# EAGLE design ArduinoProMini.NRF24.DHT.v1.01 (EAGLE 8.1.0)
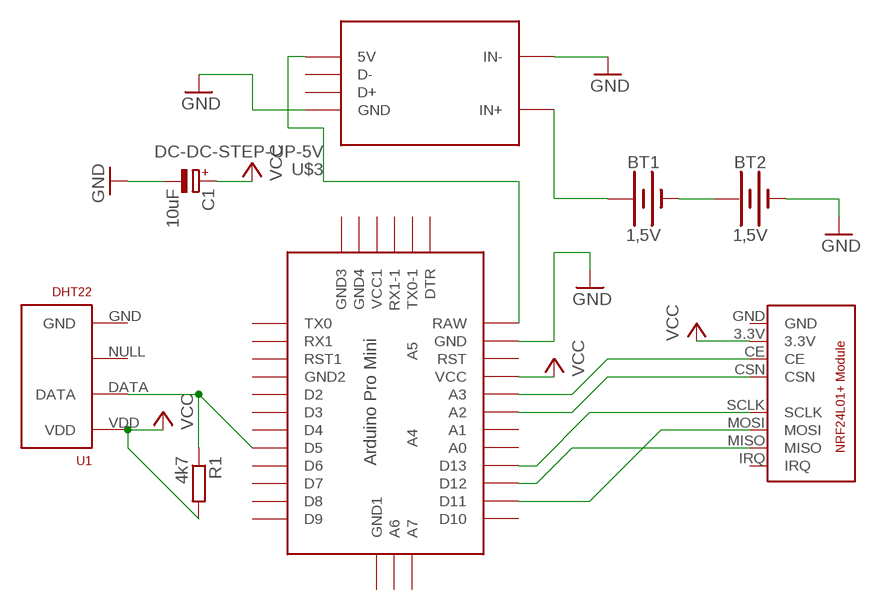
[diagram p0: schematic, sheet 1]

## Parts
BT1  1,5V  BATTERY-AA  [BATTERY-AA]
BT2  1,5V  BATTERY-AA  [BATTERY-AA]
C1  10uF  CPOL-EUE2-5  [E2-5]
R1  4k7  R-EU_0204/7  [0204/7]
U1  DHT22  RHT03_DHT-22_AM2302RA  [RHT03_DHT-22/RA]
U$1  ABK-PRO-MINI  [ABK-PRO-MINI]
U$2  NRF24L01+MODULE  [NRF24L01+MODULE]
U$3  DC-DC-STEP-UP-5V  [DC-DC-STEP-UP-5V]

## Nets
GND: BT2.GND@1(-) C1.- U$1.GND U$3.GND U$3.IN-
N$1: BT1.GND@1(-) BT2.PWR@1(+)
N$2: BT1.PWR@1(+) U$3.IN+
N$3: U$1.A3 U$2.CE
N$4: U$1.A2 U$2.CSN
N$5: U$1.D13 U$2.SCLK
N$6: U$1.D12 U$2.MISO
N$7: U$1.D11 U$2.MOSI
N$8: R1.1 U1.DATA U$1.D5
N$9: U$1.RAW U$3.5V
VCC: C1.+ R1.2 U1.VDD U$1.VCC U$2.3.3V
Unconnected: U1.NULL U$1.A0 U$1.A1 U$1.A4 U$1.A5 U$1.A6 U$1.A7 U$1.D2 U$1.D3 U$1.D4 U$1.D6 U$1.D7 U$1.D8 U$1.D9 U$1.D10 U$1.DTR U$1.GND1(GND2) U$1.GND2(GND3) U$1.GND3(GND4) U$1.GND4(GND1) U$1.RST U$1.RST1 U$1.RX1 U$1.RX1-1 U$1.TX0 U$1.TX0-1 U$1.VCC1 U$2.IRQ U$3.D+ U$3.D-

## Power pins joined to a net without a drawn wire
GND: U1.GND U$2.GND

## Library data of the parts
BT1 BT2 = SparkFun-Batteries:BATTERY: Battery - Single Cell A variety of battery chemistries, sizes, and footprints. Device List: 20MM_PTH - Coin Cell Battery Holder - 20mm (PTH) <https://www.sparkfun.com/products/783> 12MM_SMD - Coin Cell Battery Holder - 12mm (SMD) <https://www.sparkfun.com/products/10592> 12MM_PTH - Coin Cell Battery Holder - 12mm (PTH) <https://www.sparkfun.com/products/7948> 20MM_SMD - 20mm Coin Cell Battery Holder (SMD) (2 legs) Used on the Big Time Watch Kit <https://www.sparkfun.com/products/11734> 20MM_SMD_4LEGS - Coin Cell Battery Holder - 20mm (SMD) <https://www.sparkfun.com/products/11892> 20MM_SMD_4LEGS_OVERPASTE - Coin Cell Battery Holder - 20mm (SMD) <https://www.sparkfun.com/products/11892> (Over-paste on the legs) 24.5MM_PTH - Coin Cell Battery Holder - 24.5mm (PTH) <https://www.sparkfun.com/products/8863> 9V - 9V Battery Holder - PC Mount Used on the SparkFun SparkPunk Sound Kit <https://www.sparkfun.com/products/11177> and SparkFun SparkPunk Sequencer Kit <https://www.sparkfun.com/products/12707> 18650 - Battery Holder - 18650 (PTH) <https://www.sparkfun.com/products/13113> AA - Battery Holder - 1xAA (PTH) <https://www.sparkfun.com/products/7949> AAA - Battery Holder - 1xAAA (PTH) <https://www.sparkfun.com/products/12718> AA_KIT - Battery Holder - 1xAA (PTH) <https://www.sparkfun.com/products/7949> Special kit package - pads only have exposed copper on one side of the board. AAA_KIT - Battery Holder - 1xAAA (PTH) <https://www.sparkfun.com/products/12718> Special kit package - pads only have exposed copper on one side of the board.; PROD_ID: BATT-08316; SF_SKU: PRT-07949
C1 = rcl:CPOL-EU: POLARIZED CAPACITOR, European symbol
R1 = resistor:R-EU_: RESISTOR, European symbol
U1 = RHT03_DHT-22_AM2302:RHT03_DHT-22_AM2302: RHT03 / DHT-22 / AM2302 Packages and symbol for the RHT03 / DHT-22 relative humidity and temperature sensor. Note: The AM2302 is a wired version of the DHT-22 which typically requires less clearance and is thus provided as a separate package.; PROD_ID: SEN-10167
U$1 = Arduino-clone:ABK-PRO-MINI: ABK Pro-Mini Arduino Clone
U$2 = NRF24L01+ Module:NRF24L01+MODULE
U$3 = diy-modules:DC-DC-STEP-UP-5V: DC/DC Step-Up Converter

## Board
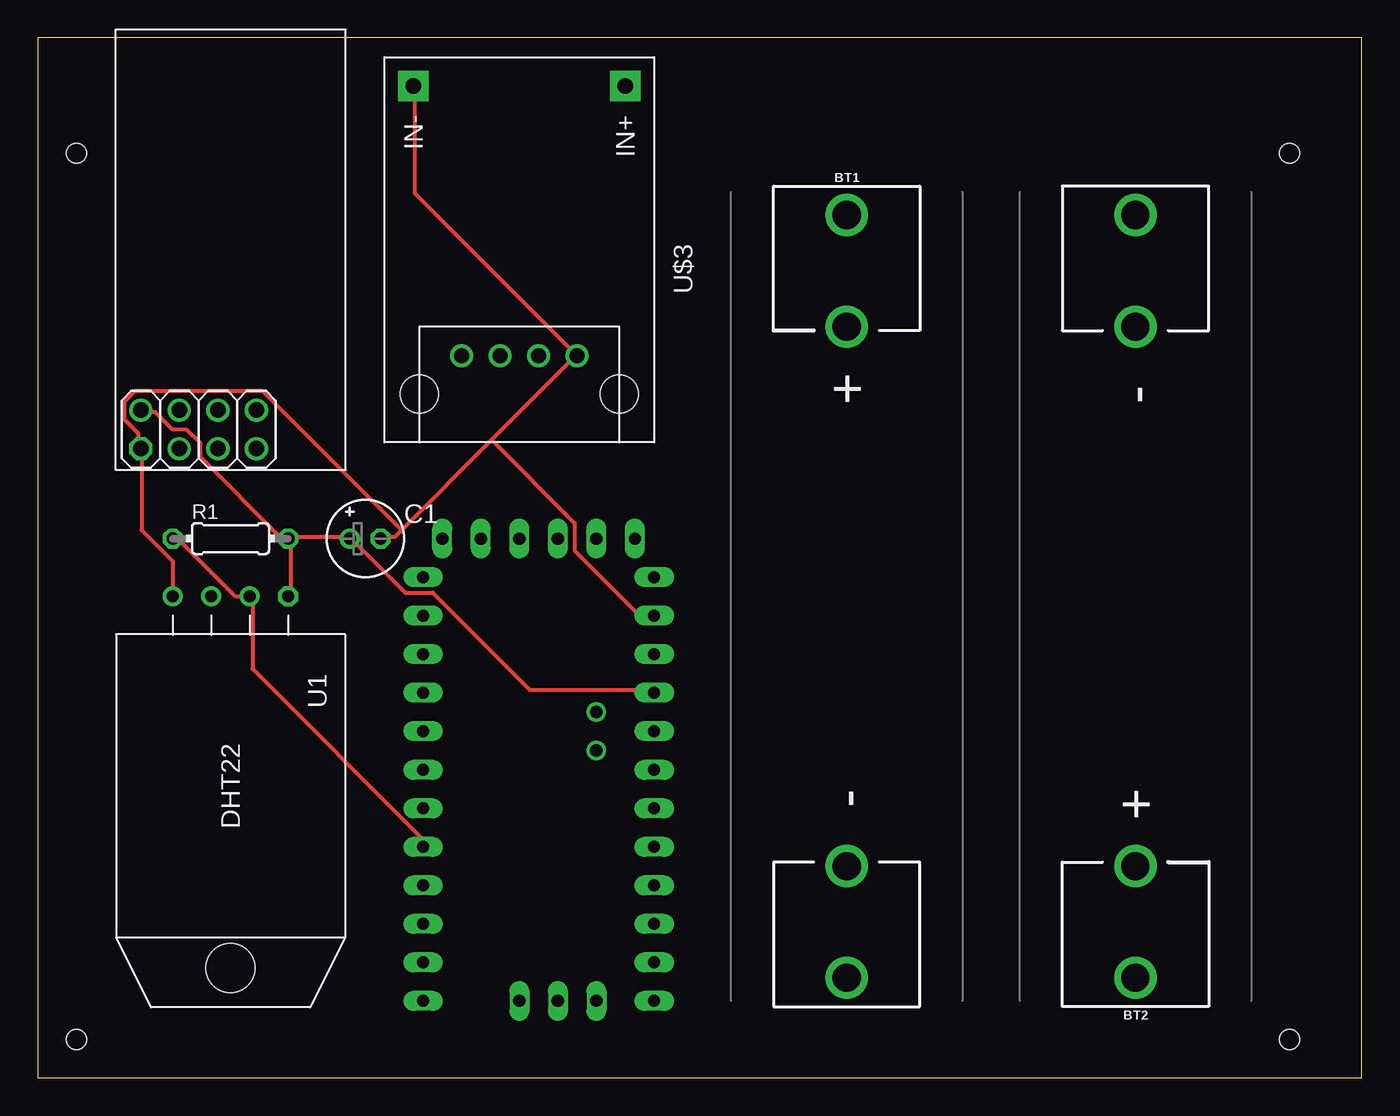
[diagram p1: board, top side]
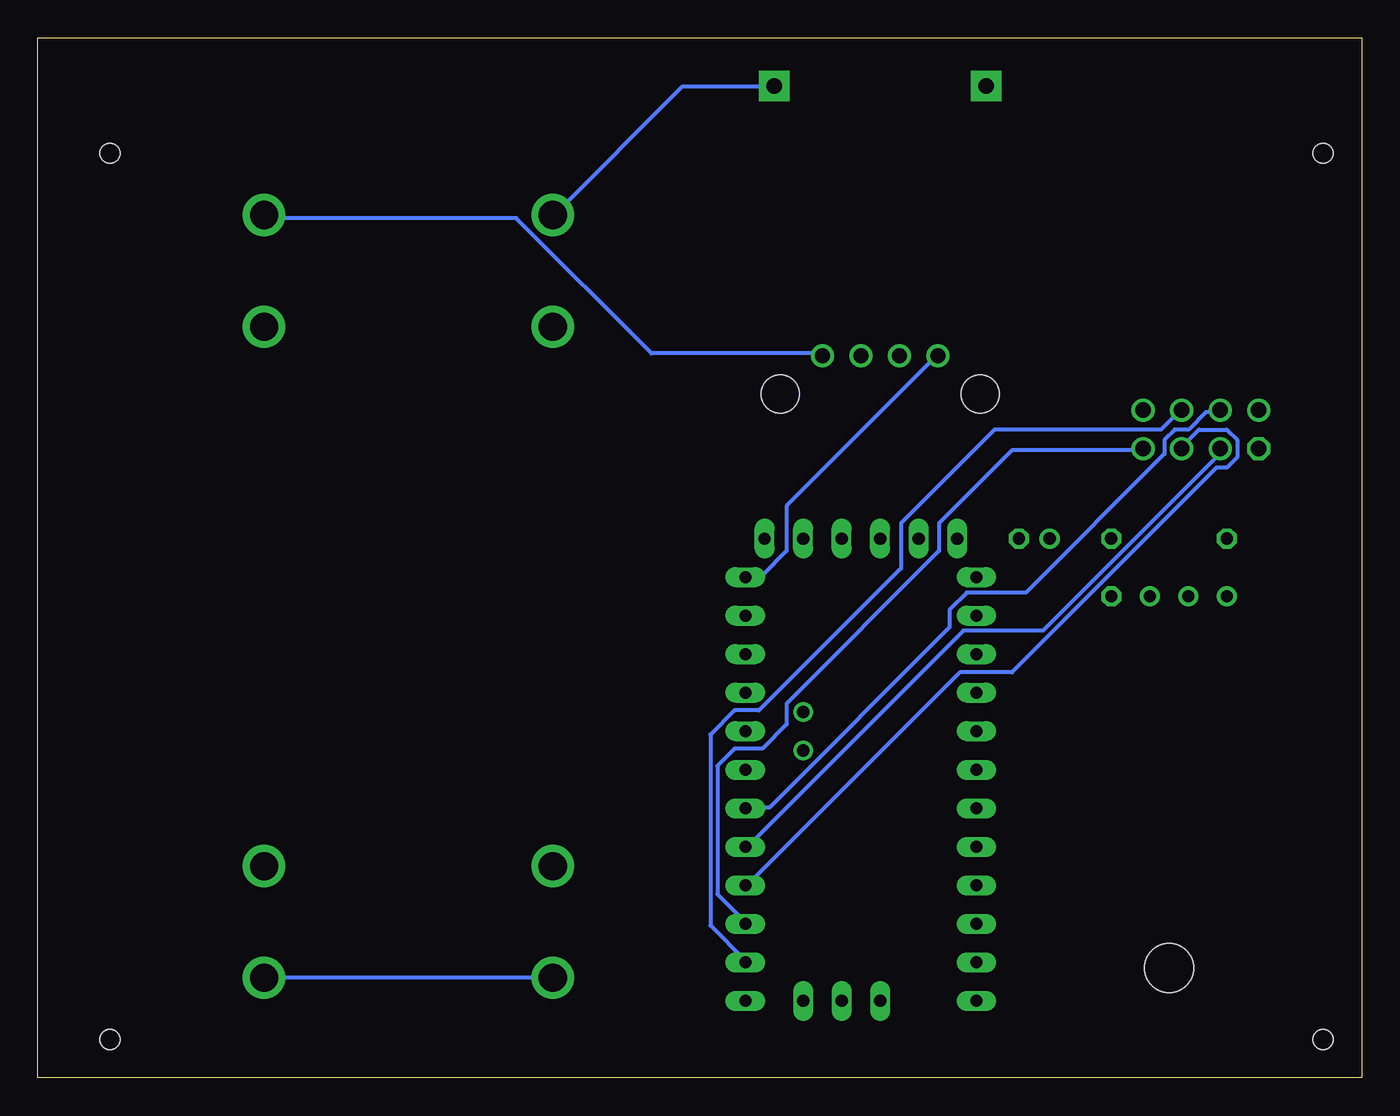
[diagram p2: board, bottom side, seen from below]

Size 87.3 x 68.57 mm. Coordinates in mm from the lower left corner, seen from the top.
Outline: 0,0 87.3,0 87.3,68.57 0,68.57 0,0
Copper layers (1*16): Top 0.035mm / dielectric 1.5mm / Bottom 0.035mm
Design rules "default": minimum track width 10mil, minimum drill 24mil, track to track 8mil, track to pad 8mil, pad to pad 8mil, via to via 8mil, smd to smd 8mil, copper to edge 40mil, drill to drill 8mil, minimum pad ring 10mil, minimum via ring 8mil, stop-mask expansion 4mil, vias tented up to drill 0mil, thermal gap 10mil
Holes 1.3 mm at 2.54,2.54 2.54,60.96 82.55,60.96 82.55,2.54

### Footprints (pad centres in the part's own frame; a part is rotated, then mirrored left to right if it is on the bottom)
BATTERY-AA = drill 1.854: GND@1 25.146,0; GND@2 17.78,0; PWR@1 -25.146,0; PWR@2 -17.78,0
E2-5 = drill 0.813 pad 1.27: + -1.016,0 | drill 0.813 pad 1.27 octagon: - 1.016,0
0204/7 = drill 0.813 octagon: 1 -3.81,0; 2 3.81,0
RHT03_DHT-22/RA = drill 0.8: DATA -1.27,0; GND 3.81,0; NULL 1.27,0 | drill 0.8 octagon: VDD -3.81,0 | hole 3.25: 0,24.5
ABK-PRO-MINI = drill 0.8 long: A0 10.16,-3.81; A1 10.16,-6.35; A2 10.16,-8.89; A3 10.16,-11.43; A6 3.81,-21.59; A7 6.35,-21.59; D2 -5.08,-3.81; D3 -5.08,-6.35; D4 -5.08,-8.89; D5 -5.08,-11.43; D6 -5.08,-13.97; D7 -5.08,-16.51; D8 -5.08,-19.05; D9 -5.08,-21.59; D10 10.16,-21.59; D11 10.16,-19.05; D12 10.16,-16.51; D13 10.16,-13.97; DTR 8.89,8.89; GND 10.16,3.81; GND1 -5.08,-1.27; GND2 -3.81,8.89; GND3 -1.27,8.89; GND4 1.27,-21.59; RAW 10.16,6.35; RST 10.16,1.27; RST1 -5.08,1.27; RX1 -5.08,3.81; RX1-1 3.81,8.89; TX0 -5.08,6.35; TX0-1 6.35,8.89; VCC 10.16,-1.27; VCC1 1.27,8.89 | drill 0.8: A4 6.35,-5.08; A5 6.35,-2.54
NRF24L01+MODULE = drill 1.016: 3.3V 10.58,-5.91; CE 13.12,-3.37; CSN 10.58,-3.37; IRQ 10.58,1.71; MISO 13.12,1.71; MOSI 10.58,-0.83; SCLK 13.12,-0.83 | drill 1.016 octagon: GND 13.12,-5.91
DC-DC-STEP-UP-5V = drill 1: 5V 6.985,-3.81; D+ 6.985,1.27; D- 6.985,-1.27; GND 6.985,3.81 | drill 1 pad 2 square: IN+ -10.795,6.985; IN- -10.795,-6.985 | hole 2.5: 9.525,6.604; 9.525,-6.604

### Placement (x,y rotation side)
BT1  53.34,31.75 270 top
BT2  72.39,31.75 90 top
C1  21.59,35.56 0 top
R1  12.7,35.56 0 top
U1  12.7,31.75 180 top
U$1  30.48,26.67 0 top
U$2  12.7,54.61 270 top
U$3  31.75,54.61 270 top

### Tracks (layer width: path | path; a pad name or v marks a point on that pad's centre or on a via)
GND
  Top 0.254: U1.GND 8.89,34.06 6.83,36.12 6.83,41.38 U$2.GND 6.6,41.6 6.6,42.52 5.69,43.43 5.69,44.58 6.37,45.26 14.83,45.26 23.98,36.12 | 29.92,42.06 35.41,47.55 U$3.GND 24.89,58.29 24.89,65.38 U$3.IN- | 29.92,42.06 23.98,36.12 | 23.98,36.12 23.52,35.66 22.61,35.66 C1.- | 29.92,42.06 35.41,36.58 35.41,34.75 39.52,30.63 40.44,30.63 U$1.GND
  Bottom 0.254: BT2.GND@1 72.21,56.69 55.75,56.69 46.84,47.78 35.64,47.78 U$3.GND
N$1
  Bottom 0.254: BT1.GND@1 53.47,6.63 72.21,6.63 BT2.PWR@1
N$2
  Bottom 0.254: U$3.IN+ 38.84,65.38 44.78,65.38 53.24,56.92 BT1.PWR@1
N$3
  Bottom 0.254: U$1.A3 40.44,15.32 26.26,29.49 21.01,29.49 9.12,41.38 U$2.CE
N$4
  Bottom 0.254: U$1.A2 40.44,17.83 39.06,17.83 27.18,29.72 27.18,30.86 26.04,32 22.15,32 13,41.15 13,42.06 12.32,42.75 11.41,42.75 10.26,43.89 9.35,43.89 U$2.CSN
N$5
  Bottom 0.254: U$1.D13 40.44,12.8 26.49,26.75 23.06,26.75 9.58,40.23 8.89,40.23 8.2,40.92 8.2,42.06 8.89,42.75 10.72,42.75 11.86,41.6 U$2.SCLK
N$6
  Bottom 0.254: U$1.D12 40.66,10.29 42.49,12.12 42.49,20.57 41.35,21.72 39.52,21.72 37.92,23.32 37.92,24.69 27.86,34.75 27.86,36.58 23.06,41.38 14.61,41.38 U$2.MISO
N$7
  Bottom 0.254: U$1.D11 40.66,7.77 42.95,10.06 42.95,22.63 41.35,24.23 39.75,24.23 30.38,33.6 30.38,36.58 24.21,42.75 13.23,42.75 12.09,43.89 U$2.MOSI
N$8
  Top 0.254: R1.1 8.89,35.43 9.35,35.43 13,31.77 13.92,31.77 U1.DATA 14.15,31.55 14.15,26.98 25.35,15.77 25.35,15.32 U$1.D5
N$9
  Bottom 0.254: U$1.RAW 40.44,33.15 39.52,33.15 37.92,34.75 37.92,37.72 28.09,47.55 U$3.5V
VCC
  Top 0.254: U1.VDD 16.66,31.77 16.66,35.43 R1.2 | U$2.3.3V 6.83,43.89 7.75,43.89 8.89,42.75 9.8,42.75 10.72,41.83 10.72,40.92 15.98,35.66 16.43,35.66 R1.2 | U$1.VCC 40.44,25.6 32.44,25.6 26.04,32 24.21,32 20.78,35.43 C1.+ 20.55,35.66 16.66,35.66 R1.2